# Altium schematic sheet Cloud_Buck_Sch.SchDoc
size A; SheetNumber: 1; SheetTotal: 1
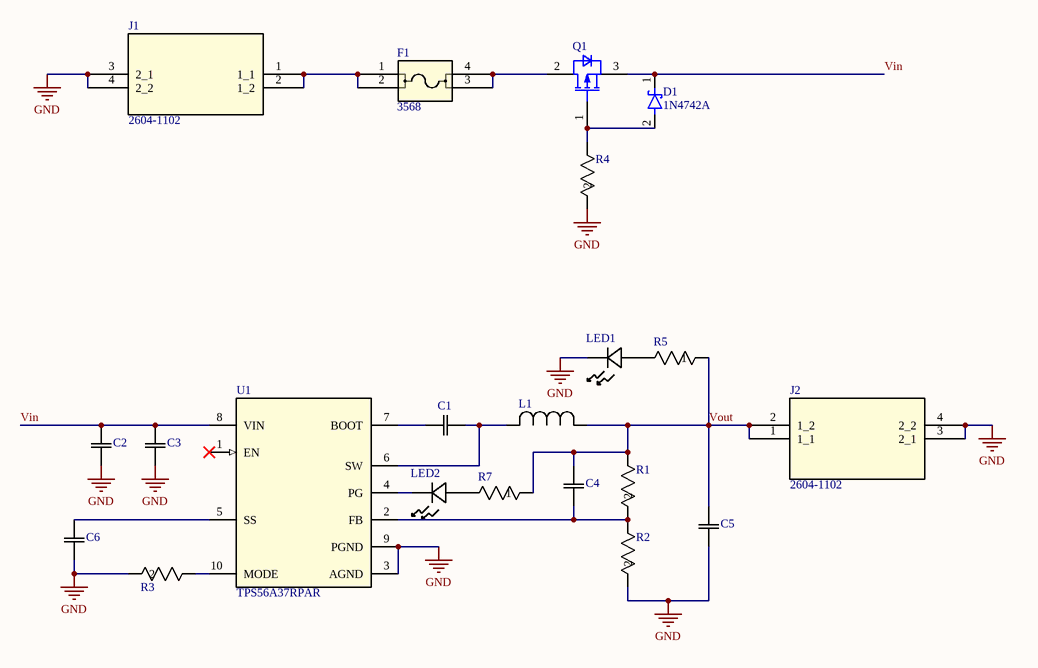
[diagram p0: Cloud_Buck_Sch.SchDoc]

## Parts
C1  EMK107B7104KA-T  [cap_UMK107ABJ474KA-T_TAY]  (value not drawn)
C2  MSASU32MSB5106KPNA01  [CAP_MSAS32-M_TAY]  (value not drawn)
C3  CC0805KRX7R9BB104  [CC0805N_YAG]  (value not drawn)
C4  GRM1885C1H101JA01D  [CAP_188_MUR]  (value not drawn)
C5  GRM32ER61C476KE15L  [G-32_MUR]  (value not drawn)
C6  GRM155R71C223KA01D  [G-155_MUR]  (value not drawn)
D1  1N4742A  [DIOAD1036W78L463D237]
F1  3568  [3568_KEY]
J1  2604-1102  [CONN2_2604-1102_WAG]
J2  2604-1102  [CONN2_2604-1102_WAG]
L1  XAL7070-332MEC  [IND_XAL7070_COC]  (value not drawn)
LED1  LTST-C170KGKT  [LED_LTST-C170KGKT_LTO]  (value not drawn)
LED2  LTST-C170KGKT  [LED_LTST-C170KGKT_LTO]  (value not drawn)
Q1  IRF4905  [IFX-PG-TO220-3-904-1]  (value not drawn)
R1  ERJ-6ENF7322V  [RC0805N_PAN]  (value not drawn)
R2  CRCW060310K0FKEA  [RES_CRCW_0603]  (value not drawn)
R3  CRCW040252K3FKED  [RES_CRCW_0402]  (value not drawn)
R4  CRCW080510K0FKEA  [RES_CRCW_0805]  (value not drawn)
R5  RC0805FR-071K5L  [RC0805N_YAG]  (value not drawn)
R7  RC0805FR-071K5L  [RC0805N_YAG]  (value not drawn)
U1  TPS56A37RPAR  [RPA0010A-MFG]

## Nets
GND: C2.1 C3.1 C5.1 C6.1 J1.3(2_1) J1.4(2_2) J2.3(2_1) J2.4(2_2) LED1.1 R2.2 R3.2 R4.2 U1.3(AGND) U1.9(PGND)
Vin: C2.2 C3.2 D1.1(K) Q1.3(SOURCE) U1.8(VIN)
Vout: C4.2 C5.2 J2.1(1_1) J2.2(1_2) L1.1 R1.1 R5.1 R7.1
NetC1_1: C1.1 U1.7(BOOT)
NetC1_2: C1.2 L1.2 U1.6(SW)
NetC4_1: C4.1 R1.2 R2.1 U1.2(FB)
NetC6_2: C6.2 U1.5(SS)
NetD1_2: D1.2(A) Q1.1(GATE) R4.1
NetF1_1: F1.1 F1.2 J1.1(1_1) J1.2(1_2)
NetF1_3: F1.3 F1.4 Q1.2(DRAIN)
NetLED1_2: LED1.2 R5.2
NetLED2_1: LED2.1 U1.4(PG)
NetLED2_2: LED2.2 R7.2
NetR3_1: R3.1 U1.10(MODE)

Not connected (* = marked no-connect by the designer): U1 1(EN)*

## Library data of the parts
C1 = EMK107B7104KA-T: Description; Manufacturer_Name: TAIYO YUDEN; Copyright: Copyright (C) 2025 Ultra Librarian. All rights reserved.; Manufacturer_Part_Number: EMK107B7104KA-T
C2 = MSASU32MSB5106KPNA01: Description; Manufacturer_Name: TAIYO YUDEN; Copyright: Copyright (C) 2026 Ultra Librarian. All rights reserved.; Manufacturer_Part_Number: MSASU32MSB5106KPNA01
C3 = CC0805KRX7R9BB104: Description; Manufacturer_Name: Yageo; Copyright: Copyright (C) 2025 Ultra Librarian. All rights reserved.; Manufacturer_Part_Number: CC0805KRX7R9BB104
C4 = GRM1885C1H101JA01D: CAP CER 100PF 50V C0G/NP0 0603; Manufacturer_Name: Murata; Copyright: Copyright (C) 2026 Ultra Librarian. All rights reserved.; Manufacturer_Part_Number: GRM1885C1H101JA01D
C5 = GRM32ER61C476KE15L: Description; Manufacturer_Name: Murata; Copyright: Copyright (C) 2025 Ultra Librarian. All rights reserved.; Manufacturer_Part_Number: GRM32ER61C476KE15L
C6 = GRM155R71C223KA01D: Description; Manufacturer_Name: Murata; Copyright: Copyright (C) 2026 Ultra Librarian. All rights reserved.; Manufacturer_Part_Number: GRM155R71C223KA01D
D1 = 1N4742A: Zener Diode, Single, Two Terminal, 12V V(Z), 5%, DO-204AL; MF: ON Semiconductor; SnapEDA_Link: https://www.snapeda.com/parts/1N4742A/Onsemi/view-part/?ref=snap; Package: DO-41 Fairchild Semiconductor; Value: *; MP: 1N4742A; Check_prices: https://www.snapeda.com/parts/1N4742A/Onsemi/view-part/?ref=eda
F1 = 3568: Description; Manufacturer_Name: Keystone Electronics; Copyright: Copyright (C) 2026 Ultra Librarian. All rights reserved.; Manufacturer_Part_Number: 3568; RefDes: RefDes; Type: Type
J1 J2 = 2604-1102: Description; Manufacturer_Name: Wago; Copyright: Copyright (C) 2025 Ultra Librarian. All rights reserved.; Manufacturer_Part_Number: 2604-1102; RefDes: RefDes; Type: Type
L1 = XAL7070-332MEC: Description; Manufacturer_Name: Coilcraft; Type: Fixed Inductors; Copyright: Copyright (C) 2026 Ultra Librarian. All rights reserved.; Manufacturer_Part_Number: XAL7070-332MEC
LED1 LED2 = LTST-C170KGKT: Description; Manufacturer_Name: LITE-ON; Copyright: Copyright (C) 2025 Ultra Librarian. All rights reserved.; Manufacturer_Part_Number: LTST-C170KGKT
Q1 = IRF4905: OptiMOS - P2 Power-Transistor, P-channel-Enhancement mode, VDS -30V; Manufacturer: Infineon Technologies; Manufacturer Order NumberManufacturer Order Number: IRF4905; PackageReference: PG-TO220-3-904
R1 = ERJ-6ENF7322V: Description; Manufacturer_Name: Panasonic; Copyright: Copyright (C) 2026 Ultra Librarian. All rights reserved.; Manufacturer_Part_Number: ERJ-6ENF7322V
R2 = CRCW060310K0FKEA: D11/CRCW0603 100 10K 1% ET1 e3; Manufacturer_Name: Vishay; Copyright: Copyright (C) 2025 Ultra Librarian. All rights reserved.; Manufacturer_Part_Number: CRCW060310K0FKEA
R3 = CRCW040252K3FKED: D10/CRCW0402 100 52K3 1% ET7 e3; Manufacturer_Name: Vishay; Copyright: Copyright (C) 2026 Ultra Librarian. All rights reserved.; Manufacturer_Part_Number: CRCW040252K3FKED
R4 = CRCW080510K0FKEA: D12/CRCW0805 100 10K 1% ET1 e3; Manufacturer_Name: Vishay; Copyright: Copyright (C) 2025 Ultra Librarian. All rights reserved.; Manufacturer_Part_Number: CRCW080510K0FKEA
R5 R7 = RC0805FR-071K5L: Description; Manufacturer_Name: Yageo; Copyright: Copyright (C) 2025 Ultra Librarian. All rights reserved.; Manufacturer_Part_Number: RC0805FR-071K5L
U1 = TPS56A37RPAR: 4.5V to 28V input, 10A synchronous buck converter 10-VQFN-HR -40 to 150; Manufacturer_Name: Texas Instruments; TYPE: TYPE; RefDes: RefDes; Copyright: Copyright (C) 2026 Ultra Librarian. All rights reserved.; Manufacturer_Part_Number: TPS56A37RPAR